# Altium schematic sheet Esquema cableado gen.SchDoc
size A1
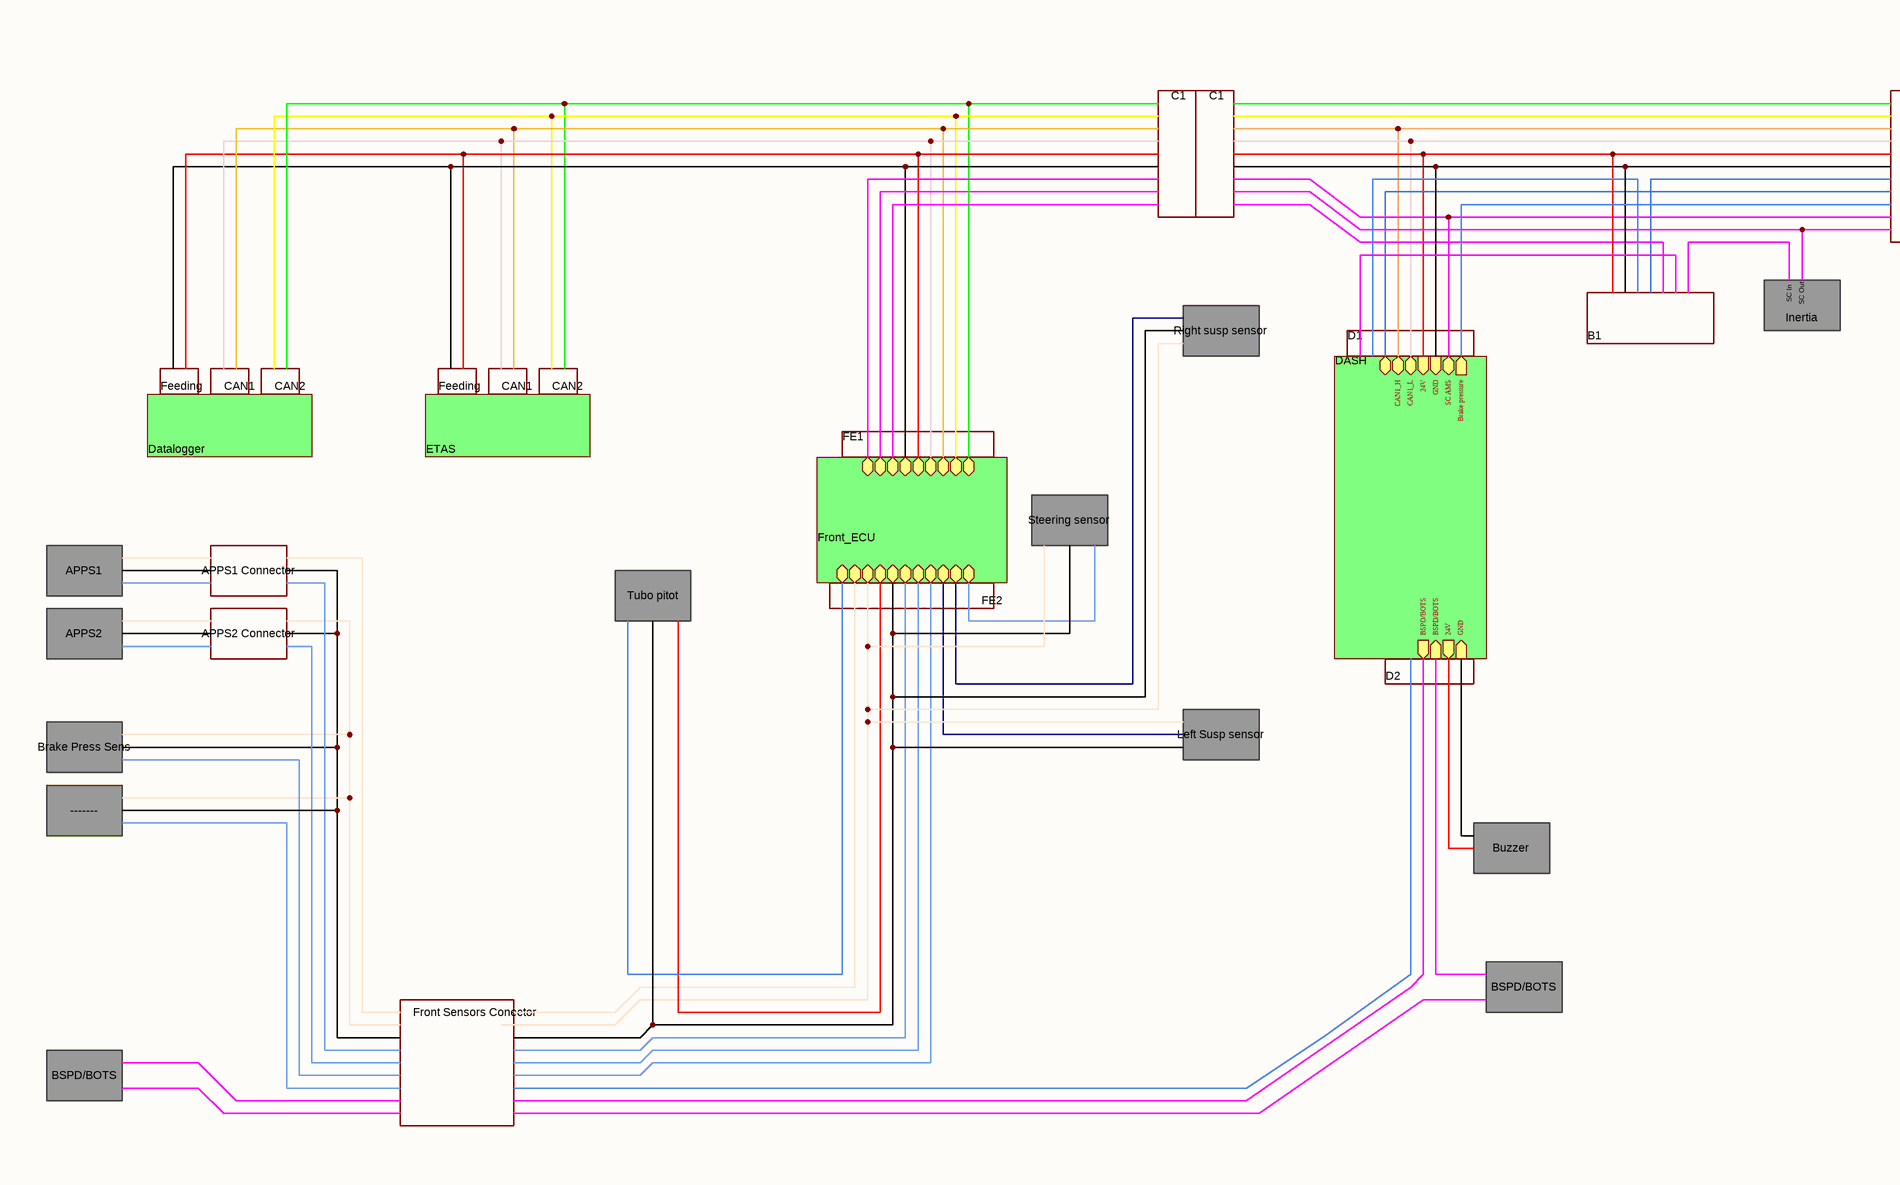
[diagram p0: Esquema cableado gen.SchDoc, left]
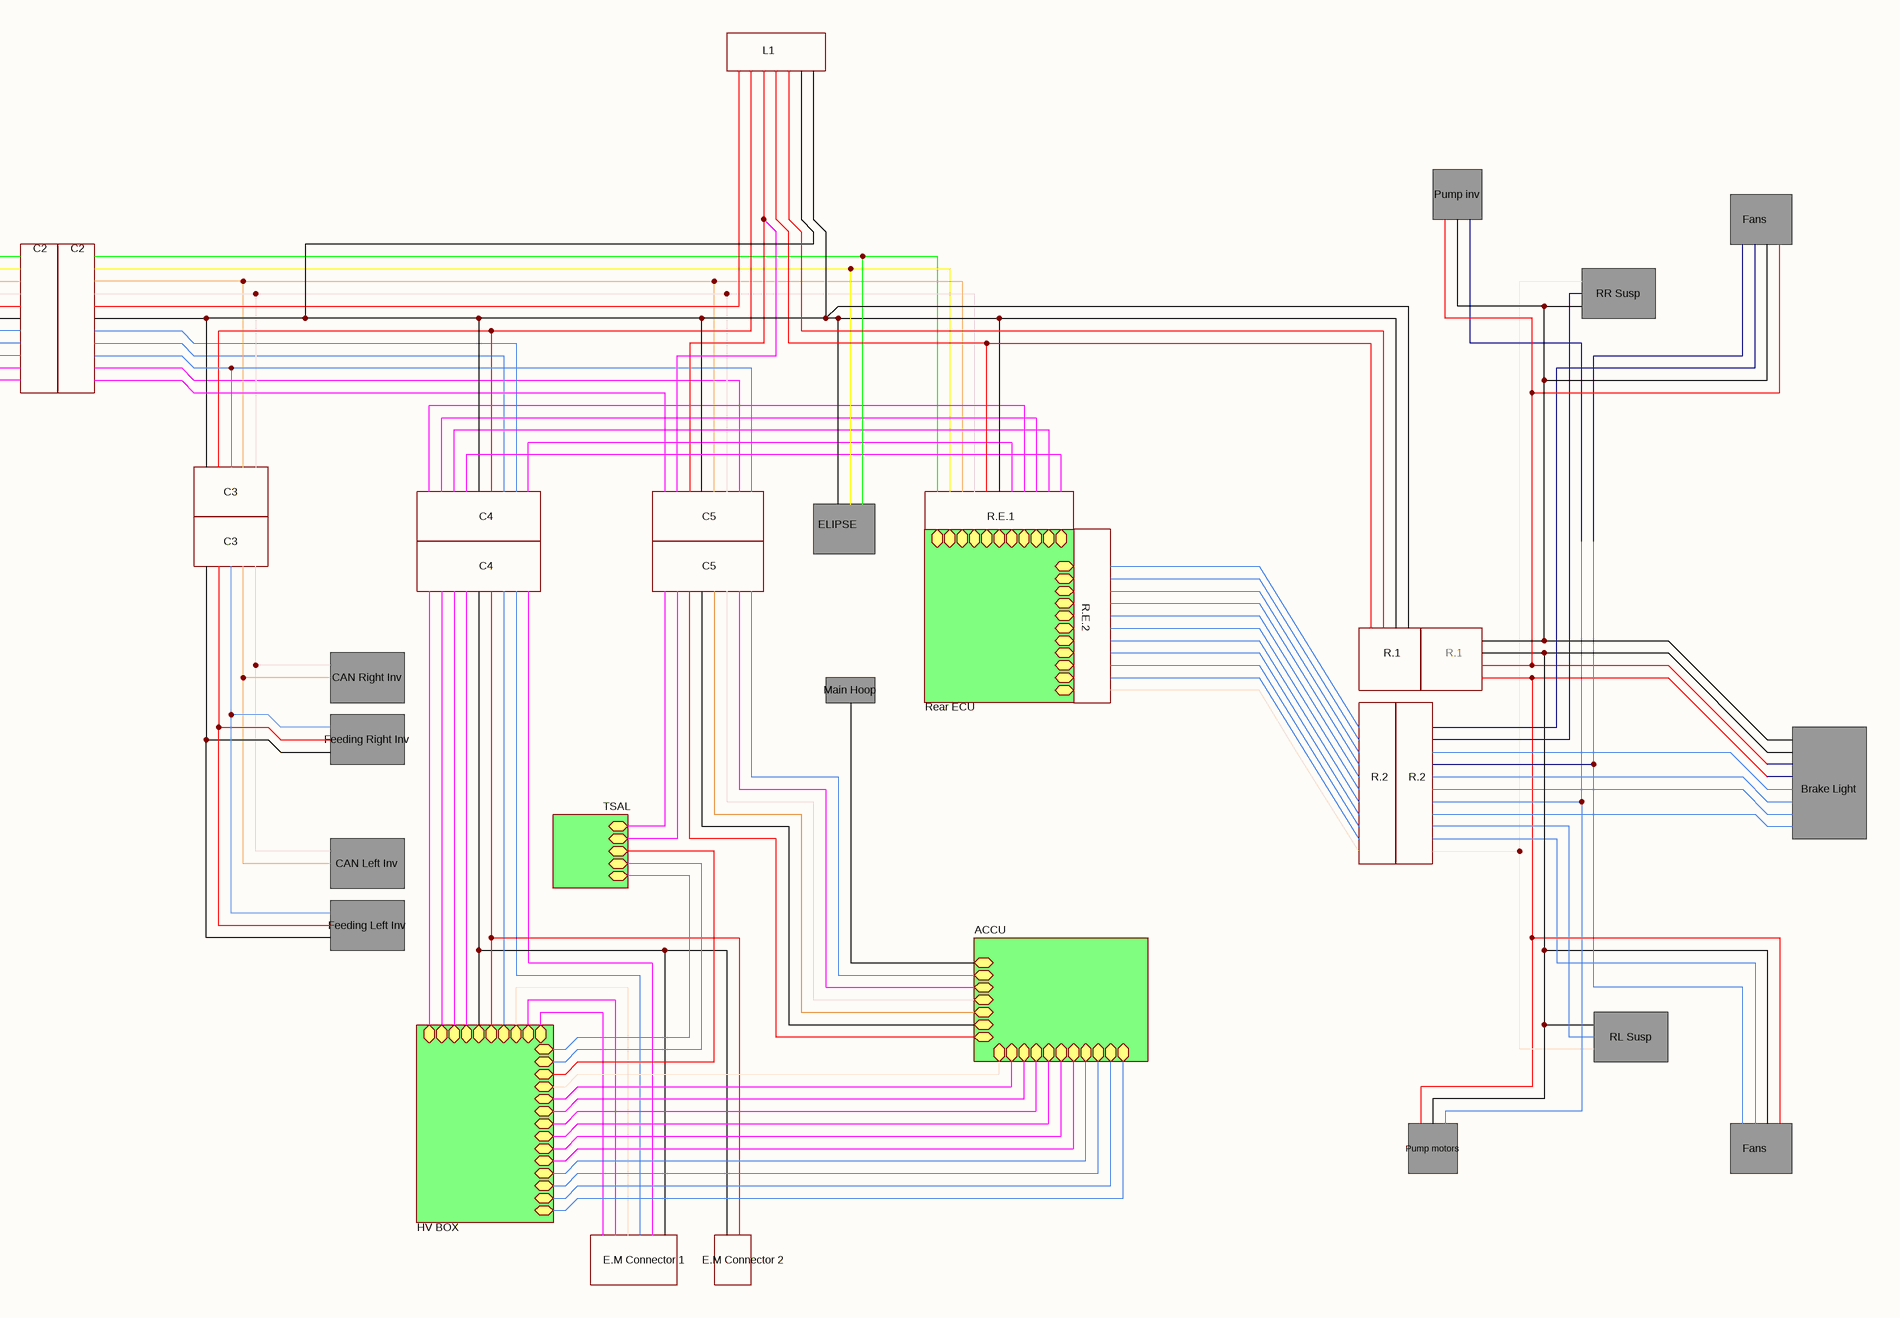
[diagram p1: Esquema cableado gen.SchDoc, right]

## Sub-sheets
Designator = DASH: CAN1_H (bidir), CAN1_L (bidir), 24V (in), GND (in), Brake pressure (out), SC AMS (bidir), GND (in), 24V (out), BSPD/BOTS (in), BSPD/BOTS (out),  (bidir)
Designator = Front_ECU:  (bidir),  (bidir),  (bidir),  (bidir),  (bidir),  (bidir),  (bidir),  (bidir),  (bidir),  (bidir),  (bidir),  (bidir),  (bidir),  (bidir),  (bidir),  (bidir),  (bidir),  (bidir),  (bidir),  (bidir)
Designator = Datalogger: no entries
Designator = ETAS: no entries
Designator = HV BOX:  (bidir),  (bidir),  (bidir),  (bidir),  (bidir),  (bidir),  (bidir),  (bidir),  (bidir),  (bidir),  (bidir),  (bidir),  (bidir),  (bidir),  (bidir),  (bidir),  (bidir),  (bidir),  (bidir),  (bidir),  (bidir),  (bidir),  (bidir),  (bidir)
Designator = TSAL:  (bidir),  (bidir),  (bidir),  (bidir),  (bidir)
Designator = ACCU:  (bidir),  (bidir),  (bidir),  (bidir),  (bidir),  (bidir),  (bidir),  (bidir),  (bidir),  (bidir),  (bidir),  (bidir),  (bidir),  (bidir),  (bidir),  (bidir),  (bidir),  (bidir)
Designator = Rear ECU:  (bidir),  (bidir),  (bidir),  (bidir),  (bidir),  (bidir),  (bidir),  (bidir),  (bidir),  (bidir),  (bidir),  (bidir),  (bidir),  (bidir),  (bidir),  (bidir),  (bidir),  (bidir),  (bidir),  (bidir),  (bidir),  (bidir)

## Nets
(unnamed): sheet Designator/, sheet Designator/
(unnamed): sheet Designator/, sheet Designator/
(unnamed): sheet Designator/, sheet Designator/
(unnamed): sheet Designator/, sheet Designator/
(unnamed): sheet Designator/, sheet Designator/
(unnamed): sheet Designator/, sheet Designator/
(unnamed): sheet Designator/, sheet Designator/
(unnamed): sheet Designator/, sheet Designator/
(unnamed): sheet Designator/, sheet Designator/
(unnamed): sheet Designator/, sheet Designator/
(unnamed): sheet Designator/, sheet Designator/
(unnamed): sheet Designator/, sheet Designator/
(unnamed): sheet Designator/, sheet Designator/
(unnamed): sheet Designator/, sheet Designator/

## Notes on the sheet
- L1
- Pump inv
- C1
- C2
- Fans
- RR Susp
- SC In
- SC Out
- Right susp sensor
- D1
- B1
- Inertia
- C3
- Feeding
- CAN1
- CAN2
- C4
- C5
- ELIPSE
- R.E.1
- FE1
- R.E.2
- Steering sensor
- CAN Right Inv
- Main Hoop
- R.1
- APPS1
- APPS1 Connector
- Tubo pitot
- FE2
- Feeding Right Inv
- APPS2
- APPS2 Connector
- R.2
- Brake Light
- Left Susp sensor
- D2
- CAN Left Inv
- Brake Press Sens
- Feeding Left Inv
- -------
- Buzzer
- RL Susp
- BSPD/BOTS
- Front Sensors Conector
- Pump motors
- E.M Connector 1
- E.M Connector 2
- Title
- Size:
- Date:
- File:
- A1
- Number:
- Time:
- Revision:
- Sheet
- of